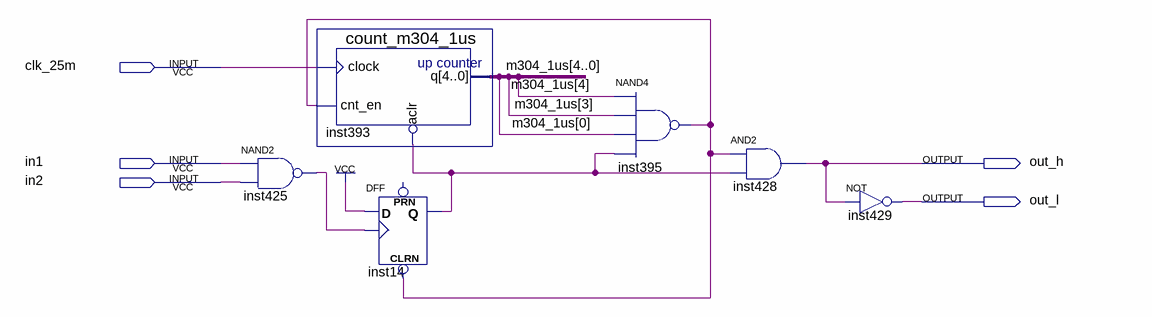
[diagram p0: schematic sheet]
// Quartus schematic m304-1us.bdf as structural Verilog: 6 symbols, 5 pins
module \m304-1us  (
  input  clk_25m,
  input  in1,
  input  in2,
  output out_h,
  output out_l
);

  wire inst14_q, inst395_out, inst425_out;
  wire [4:0] m304_1us;

  nand inst425 (inst425_out, in1, in2);
  count_m304_1us inst393 (.aclr(~inst14_q), .clock(clk_25m), .cnt_en(inst395_out), .q(m304_1us));
  DFF inst14 (.CLRN(inst395_out), .CLK(inst425_out), .D(1'b1), .Q(inst14_q));  // open: PRN
  nand inst395 (inst395_out, m304_1us[4], m304_1us[3], m304_1us[0], inst14_q);
  and inst428 (out_h, inst395_out, inst14_q);
  not inst429 (out_l, out_h);
endmodule
